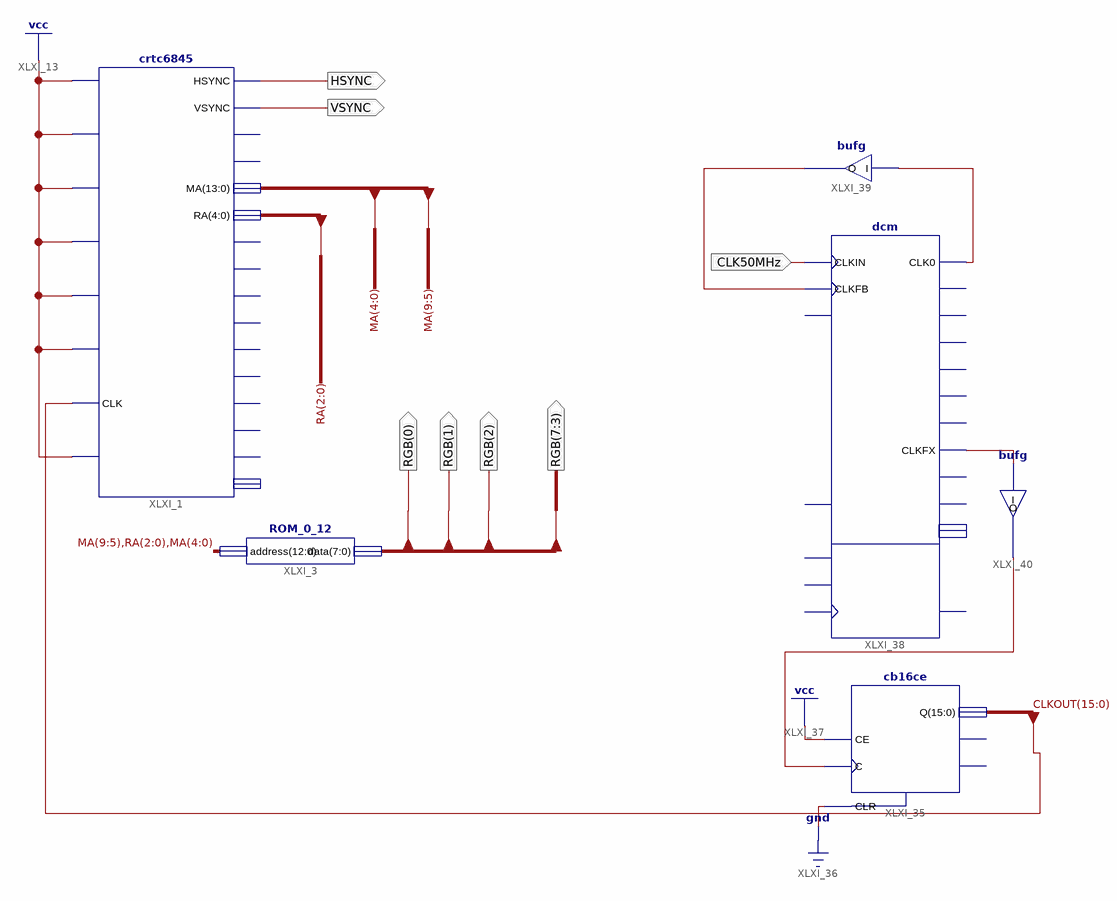
[diagram p0: schematic sheet 1]
// Xilinx ISE schematic full_graphic_display.sch (spartan3) as structural Verilog: 6 symbols, 7 ports
module full_graphic_display (
  input  CLK50MHz,
  output HSYNC,
  output VSYNC,
  output [7:0] RGB
);

  wire CLK1MHz, XLXN_72, XLXN_73, XLXN_74;
  wire [4:0] RA;
  wire [13:0] MA;
  wire [15:0] CLKOUT;

  crtc6845 XLXI_1 (
    .LPSTBn(1'b1), .E(1'b1), .RS(1'b1), .CSn(1'b1), .RW(1'b1), .RESETn(1'b1), .CLK(CLKOUT[5]),
    .REG_INIT(1'b1), .HSYNC(HSYNC), .VSYNC(VSYNC), .MA(MA), .RA(RA));  // open: DE, CURSOR, Hend, HS, CHROW_CLK, Vend, SLadj, H, V, CURSOR_ACTIVE, VERT_RST, D
  ROM_0_12 XLXI_3 (.address({MA[9:5], RA[2:0], MA[4:0]}), .data(RGB));
  dcm #(.CLKFX_MULTIPLY(2), .CLKFX_DIVIDE(3)) XLXI_38 (
    .CLKFB(XLXN_74), .CLKIN(CLK50MHz), .CLK0(XLXN_73), .CLKFX(XLXN_72));  // open: DSSEN, PSCLK, PSEN, PSINCDEC, RST, CLK180, CLK270, CLK2X, CLK2X180, CLK90, CLKDV, CLKFX180, LOCKED, PSDONE, STATUS
  bufg XLXI_39 (.I(XLXN_73), .O(XLXN_74));
  bufg XLXI_40 (.I(XLXN_72), .O(CLK1MHz));
  cb16ce XLXI_35 (.C(CLK1MHz), .CE(1'b1), .CLR(1'b0), .Q(CLKOUT));  // open: CEO, TC
endmodule
